# Altium schematic sheet lv_io_main_connector.SchDoc: nav_main_connector.schdoc
size A4; Engineer: Ryan Castle; Organization: Badgerloop; Address1: 133 Engineering Research; Address2: Building; Address3: Madison, WI 53715; DocumentNumber: 1; Revision: A; SheetNumber: 2; SheetTotal: 2
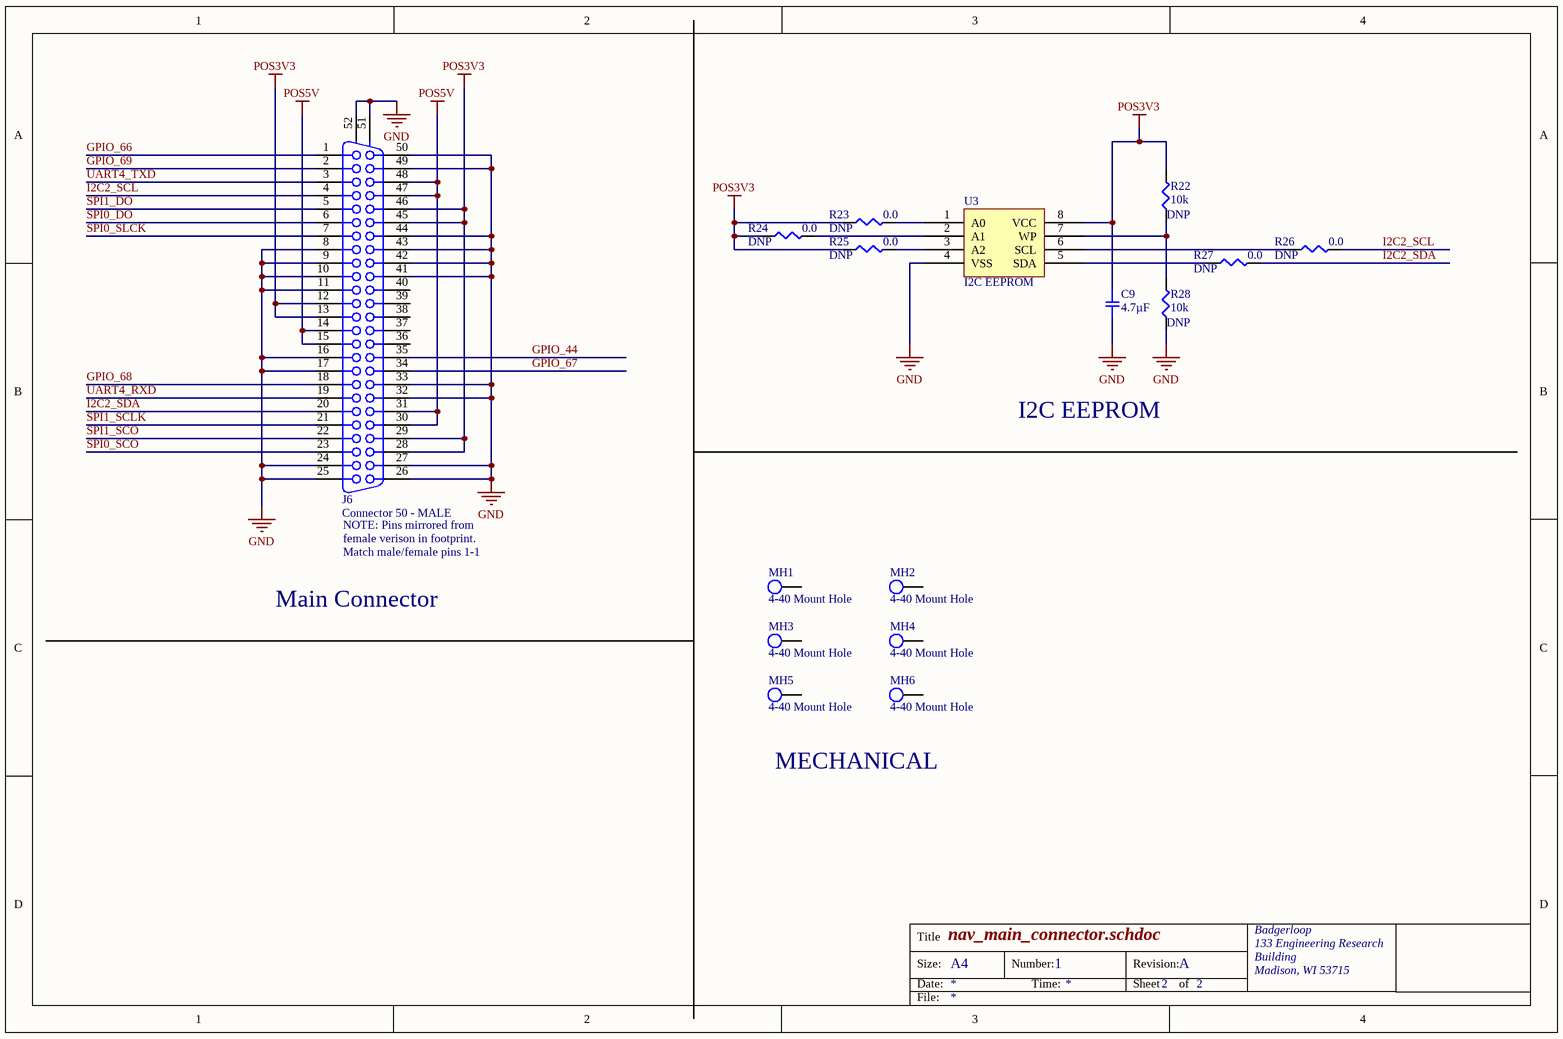
[diagram p0: lv_io_main_connector.SchDoc]

## Parts
C9  4.7µF  [SMD-0805C]
J6  Connector 50 - MALE  [050DSUB1.27-H96-MALE]
MH1  4-40 Mount Hole  [MH]
MH2  4-40 Mount Hole  [MH]
MH3  4-40 Mount Hole  [MH]
MH4  4-40 Mount Hole  [MH]
MH5  4-40 Mount Hole  [MH]
MH6  4-40 Mount Hole  [MH]
R22  10k  [SMD-0402-RES]
R23  0.0  [SMD-0402-RES]
R24  0.0  [SMD-0402-RES]
R25  0.0  [SMD-0402-RES]
R26  0.0  [SMD-0402-RES]
R27  0.0  [SMD-0402-RES]
R28  10k  [SMD-0402-RES]
U3  I2C EEPROM  [SOIC127P600X175-8N]

## Nets
GND: C9.2 J6.8 J6.9 J6.10 J6.11 J6.16 J6.17 J6.24 J6.25 J6.26 J6.27 J6.32 J6.33 J6.41 J6.42 J6.43 J6.44 J6.49 J6.50 J6.51 J6.52 R28.1 U3.4(VSS)
POS3V3: C9.1 J6.12 J6.13 J6.28 J6.29 J6.45 J6.46 R22.2 R23.1 R24.1 R25.1 U3.8(VCC)
POS5V: J6.14 J6.15 J6.30 J6.31 J6.47 J6.48
GPIO_44: J6.35
GPIO_66: J6.1
GPIO_67: J6.34
GPIO_68: J6.18
GPIO_69: J6.2
I2C2_SCL: J6.4 R26.2
I2C2_SDA: J6.20 R27.2
SPI0_DO: J6.6
SPI0_SCO: J6.23
SPI0_SLCK: J6.7
SPI1_DO: J6.5
SPI1_SCLK: J6.21
SPI1_SCO: J6.22
UART4_RXD: J6.19
UART4_TXD: J6.3
NetR22_1: R22.1 R28.2 U3.7(WP)
NetR23_2: R23.2 U3.1(A0)
NetR24_2: R24.2 U3.2(A1)
NetR25_2: R25.2 U3.3(A2)
NetR26_1: R26.1 U3.6(SCL)
NetR27_1: R27.1 U3.5(SDA)

Not connected (* = marked no-connect by the designer): J6 36 37 38 39 40; MH1 46; MH2 46; MH3 46; MH4 46; MH5 46; MH6 46

## Notes on the sheet
- I2C EEPROM
- (near J6) NOTE: Pins mirrored from
- Match male/female pins 1-1
- female verison in footprint.
- Main Connector
- MECHANICAL
- Title
- Size:
- Date:
- A4
- Number:
- Time:
- Revision:
- Sheet
- of
- File:

## Library data of the parts
C9 = GCJ21BR71C475KA01L: CAP CER 4.7UF 16V X7R 0805; Manufacturer: Murata Electronics North America; Factory Stock: 0; Unit Price (USD): 0.44; Minimum Quantity: 1; Tolerance: ±10%; Datasheets: http://www.murata.com/~/media/webrenewal/support/library/catalog/products/capacitor/mlcc/c03e.ashx; Image: //media.digikey.com/Renders/Murata%20Renders/0805%20(2012%20Metric)%20.85mm.jpg; Digi-Key Part Number: 490-10557-1-ND; Part Number: GCJ21BR71C475KA01L; Quantity Available: 53217; @ qty: 0; Packaging: Cut Tape (CT); Series: GCJ; Part Status: Active; Value: 4.7µF; Voltage: 16V; Temperature Coefficient: X7R; Operating Temperature: -55°C ~ 125°C; Features: Soft Termination; Ratings: AEC-Q200; Applications: Automotive, Boardflex Sensitive; Mounting Type: Surface Mount, MLCC; Package / Case: 0805 (2012 Metric); Size / Dimension: 0.079" L x 0.049" W (2.00mm x 1.25mm); Height - Seated (Max): -; Thickness (Max): 0.057" (1.45mm); Lead Spacing: -; Lead Style: -
J6 = Connector 50 - MALE: Receptacle Header Assemby; Manufacturer: HARTING; Manufacturer P/N: 09665627811; Digikey Link: https://www.digikey.com/product-detail/en/harting/09665627811/1195-5057-ND/4322749; Digikey P/N: 1195-5057-ND
R22 R28 = ERJ-2GEJ103X: RES SMD 10K OHM 5% 1/10W 0402; Manufacturer: Panasonic Electronic Components; Factory Stock: 0; Unit Price (USD): 0.00350; @ qty: 1500; Minimum Quantity: 1; Power (Watts): 0.1W, 1/10W; Temperature Coefficient: ±200ppm/°C; Part Number: ERJ-2GEJ103X; Datasheets: http://industrial.panasonic.com/www-cgi/jvcr13pz.cgi?E+PZ+3+AOA0001+ERJ2GEJ103X+7+WW; Image: //media.digikey.com/Photos/Panasonic%20Photos/ERJ-PA2-Series.jpg; Digi-Key Part Number: P10KJCT-ND; Quantity Available: 2560215; Packaging: Cut Tape (CT); Series: ERJ; Part Status: Active; Value: 10k; Tolerance: ±5%; Composition: Thick Film; Features: Automotive AEC-Q200; Operating Temperature: -55°C ~ 155°C; Package / Case: 0402 (1005 Metric); Supplier Device Package: 0402; Size / Dimension: 0.039" L x 0.020" W (1.00mm x 0.50mm); Height - Seated (Max): 0.016" (0.40mm); Number of Terminations: 2; Failure Rate: -; DNP: DNP
R23-R27 = ERJ-2GE0R00X: RES SMD 0.0OHM JUMPER 1/10W 0402; Manufacturer: Panasonic Electronic Components; Factory Stock: 0; Unit Price (USD): 0.00384; @ qty: 1500; Minimum Quantity: 1; Power (Watts): 0.1W, 1/10W; Part Number: ERJ-2GE0R00X; Datasheets: http://industrial.panasonic.com/www-cgi/jvcr13pz.cgi?E+PZ+3+AOA0001+ERJ2GE0R00X+7+WW; Image: //media.digikey.com/Photos/Panasonic%20Photos/ERJ-PA2-Series.jpg; Digi-Key Part Number: P0.0JCT-ND; Quantity Available: 3152483; Packaging: Cut Tape (CT); Series: ERJ; Part Status: Active; Value: 0.0; Tolerance: Jumper; Composition: Thick Film; Features: Automotive AEC-Q200; Temperature Coefficient: -; Operating Temperature: -55°C ~ 155°C; Package / Case: 0402 (1005 Metric); Supplier Device Package: 0402; Size / Dimension: 0.039" L x 0.020" W (1.00mm x 0.50mm); Height - Seated (Max): 0.016" (0.40mm); Number of Terminations: 2; Failure Rate: -; DNP: DNP
U3 = I2C EEPROM: IC EEPROM 32K I2C 1MHZ 8SOIC; Manufacturer: ON Semi; Manufacturer P/N: CAT24C32WI-GT3; Digikey P/N: CAT24C32WI-Gt3CT-ND